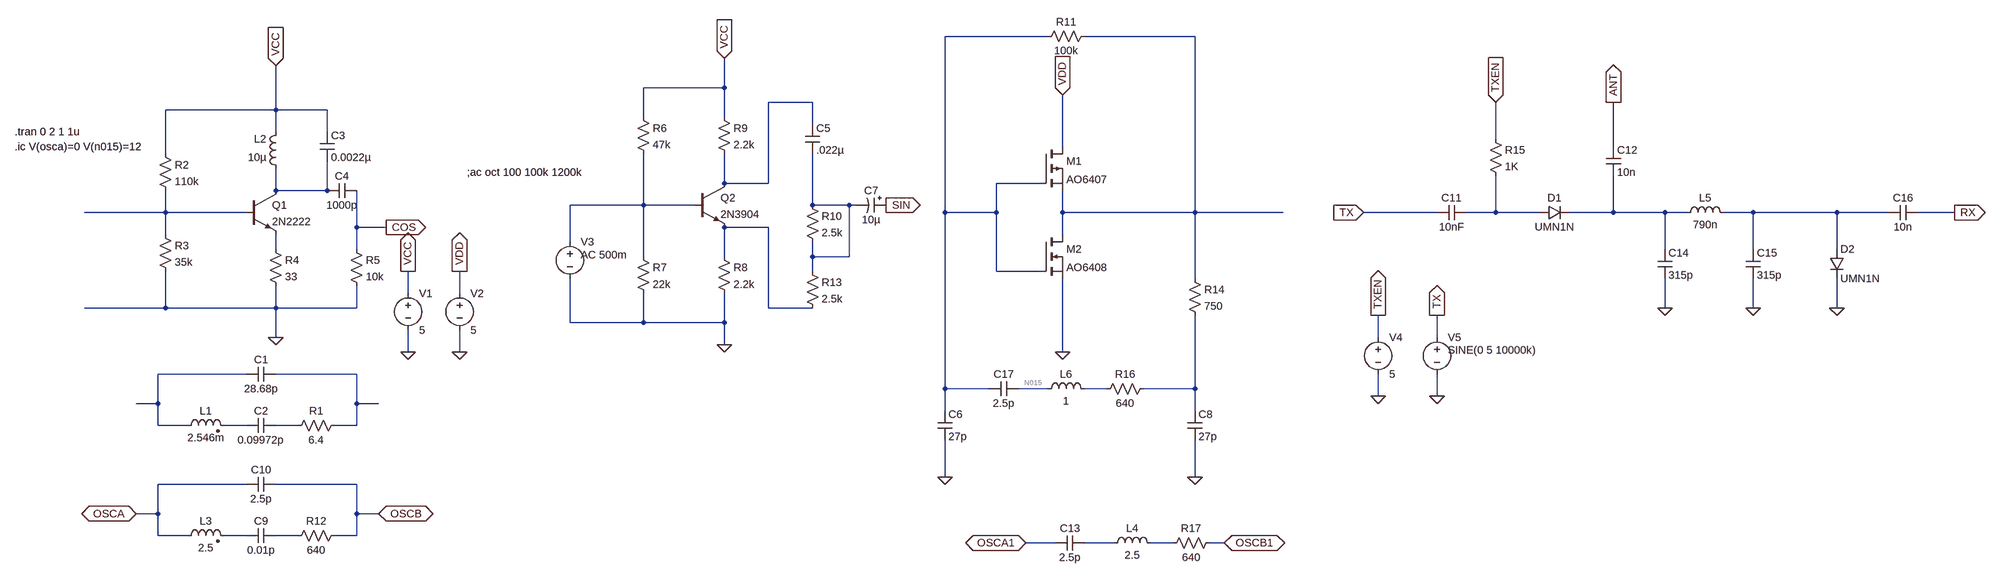
[diagram p0: schematic Draft1.asc]
Draft1.asc, the LTspice schematic file:
Version 4
SHEET 1 4968 712
WIRE 2784 -528 2560 -528
WIRE 3104 -528 2864 -528
WIRE 2080 -416 2080 -480
WIRE 2080 -416 1904 -416
WIRE 2272 -384 2176 -384
WIRE 1104 -368 1104 -464
WIRE 1104 -368 864 -368
WIRE 1216 -368 1104 -368
WIRE 1904 -352 1904 -416
WIRE 2080 -352 2080 -416
WIRE 2272 -336 2272 -384
WIRE 1104 -320 1104 -368
WIRE 1216 -320 1216 -368
WIRE 3872 -304 3872 -384
WIRE 2816 -288 2816 -400
WIRE 4128 -288 4128 -384
WIRE 864 -272 864 -368
WIRE 2080 -208 2080 -272
WIRE 2176 -208 2176 -384
WIRE 2176 -208 2080 -208
WIRE 2768 -208 2672 -208
WIRE 1104 -192 1104 -240
WIRE 1216 -192 1216 -256
WIRE 1216 -192 1104 -192
WIRE 1904 -160 1904 -272
WIRE 1904 -160 1744 -160
WIRE 2016 -160 1904 -160
WIRE 2272 -160 2272 -272
WIRE 2352 -160 2272 -160
WIRE 2368 -160 2352 -160
WIRE 864 -144 864 -192
WIRE 864 -144 688 -144
WIRE 1040 -144 864 -144
WIRE 2560 -144 2560 -528
WIRE 2672 -144 2672 -208
WIRE 2672 -144 2560 -144
WIRE 2816 -144 2816 -192
WIRE 3104 -144 3104 -528
WIRE 3104 -144 2816 -144
WIRE 3296 -144 3104 -144
WIRE 3744 -144 3584 -144
WIRE 3872 -144 3872 -224
WIRE 3872 -144 3808 -144
WIRE 3968 -144 3872 -144
WIRE 4128 -144 4128 -224
WIRE 4128 -144 4032 -144
WIRE 4240 -144 4128 -144
WIRE 4288 -144 4240 -144
WIRE 4432 -144 4368 -144
WIRE 4624 -144 4432 -144
WIRE 4736 -144 4624 -144
WIRE 4880 -144 4800 -144
WIRE 1280 -112 1280 -192
WIRE 1344 -112 1280 -112
WIRE 2176 -112 2080 -112
WIRE 864 -96 864 -144
WIRE 2816 -96 2816 -144
WIRE 1744 -80 1744 -160
WIRE 1104 -64 1104 -96
WIRE 1280 -64 1280 -112
WIRE 4240 -64 4240 -144
WIRE 4432 -64 4432 -144
WIRE 4624 -64 4624 -144
WIRE 1904 -48 1904 -160
WIRE 2080 -48 2080 -112
WIRE 2272 -48 2272 -80
WIRE 2352 -48 2352 -160
WIRE 2352 -48 2272 -48
WIRE 2272 -16 2272 -48
WIRE 2672 -16 2672 -144
WIRE 2768 -16 2672 -16
WIRE 3104 0 3104 -144
WIRE 1392 32 1392 -16
WIRE 1504 32 1504 -16
WIRE 864 64 864 -16
WIRE 864 64 688 64
WIRE 1104 64 1104 16
WIRE 1104 64 864 64
WIRE 1280 64 1280 16
WIRE 1280 64 1104 64
WIRE 2176 64 2176 -112
WIRE 2272 64 2176 64
WIRE 4240 64 4240 0
WIRE 4432 64 4432 0
WIRE 4624 64 4624 0
WIRE 1744 96 1744 0
WIRE 1904 96 1904 32
WIRE 1904 96 1744 96
WIRE 2080 96 2080 32
WIRE 2080 96 1904 96
WIRE 1104 128 1104 64
WIRE 3616 128 3616 80
WIRE 3744 128 3744 80
WIRE 2080 144 2080 96
WIRE 1392 160 1392 112
WIRE 1504 160 1504 112
WIRE 2816 160 2816 0
WIRE 1040 208 848 208
WIRE 1280 208 1104 208
WIRE 2560 240 2560 -144
WIRE 2656 240 2560 240
WIRE 2784 240 2720 240
WIRE 2912 240 2864 240
WIRE 3104 240 3104 80
WIRE 3104 240 2992 240
WIRE 3616 256 3616 208
WIRE 3744 256 3744 208
WIRE 848 272 848 208
WIRE 848 272 800 272
WIRE 1280 272 1280 208
WIRE 1328 272 1280 272
WIRE 2560 288 2560 240
WIRE 3104 288 3104 240
WIRE 848 320 848 272
WIRE 912 320 848 320
WIRE 1040 320 992 320
WIRE 1152 320 1104 320
WIRE 1280 320 1280 272
WIRE 1280 320 1232 320
WIRE 2560 432 2560 352
WIRE 3104 432 3104 352
WIRE 1040 448 848 448
WIRE 1280 448 1104 448
WIRE 848 512 848 448
WIRE 848 512 800 512
WIRE 1280 512 1280 448
WIRE 1328 512 1280 512
WIRE 848 560 848 512
WIRE 912 560 848 560
WIRE 1040 560 992 560
WIRE 1152 560 1104 560
WIRE 1280 560 1280 512
WIRE 1280 560 1232 560
WIRE 2800 576 2736 576
WIRE 2928 576 2864 576
WIRE 3056 576 3008 576
WIRE 3168 576 3136 576
FLAG 1392 -16 VCC
IOPIN 1392 -16 Out
FLAG 1104 -464 VCC
IOPIN 1104 -464 In
FLAG 1104 128 0
FLAG 1392 160 0
FLAG 1504 160 0
FLAG 1504 -16 VDD
IOPIN 1504 -16 Out
FLAG 2080 144 0
FLAG 1344 -112 COS
IOPIN 1344 -112 Out
FLAG 2432 -160 SIN
IOPIN 2432 -160 Out
FLAG 2080 -480 VCC
IOPIN 2080 -480 In
FLAG 800 512 OSCA
IOPIN 800 512 BiDir
FLAG 1328 512 OSCB
IOPIN 1328 512 BiDir
FLAG 2816 -400 VDD
IOPIN 2816 -400 In
FLAG 2816 160 0
FLAG 2560 432 0
FLAG 3104 432 0
FLAG 3872 -384 TXEN
IOPIN 3872 -384 In
FLAG 4240 64 0
FLAG 4432 64 0
FLAG 4624 64 0
FLAG 3616 256 0
FLAG 3616 80 TXEN
IOPIN 3616 80 Out
FLAG 3744 256 0
FLAG 3744 80 TX
IOPIN 3744 80 Out
FLAG 3584 -144 TX
IOPIN 3584 -144 In
FLAG 4880 -144 RX
IOPIN 4880 -144 Out
FLAG 4128 -384 ANT
IOPIN 4128 -384 Out
FLAG 2736 576 OSCA1
IOPIN 2736 576 BiDir
FLAG 3168 576 OSCB1
IOPIN 3168 576 BiDir
SYMBOL ind2 896 336 R270
WINDOW 0 32 56 VTop 2
WINDOW 3 5 56 VBottom 2
SYMATTR InstName L1
SYMATTR Value 2.546m
SYMATTR Type ind
SYMBOL cap 1104 304 R90
WINDOW 0 0 32 VBottom 2
WINDOW 3 32 32 VTop 2
SYMATTR InstName C2
SYMATTR Value 0.09972p
SYMBOL res 1248 304 R90
WINDOW 0 0 56 VBottom 2
WINDOW 3 32 56 VTop 2
SYMATTR InstName R1
SYMATTR Value 6.4
SYMBOL cap 1104 192 R90
WINDOW 0 0 32 VBottom 2
WINDOW 3 32 32 VTop 2
SYMATTR InstName C1
SYMATTR Value 28.68p
SYMBOL res 848 -288 R0
SYMATTR InstName R2
SYMATTR Value 110k
SYMBOL res 848 -112 R0
SYMATTR InstName R3
SYMATTR Value 35k
SYMBOL npn 1040 -192 R0
SYMATTR InstName Q1
SYMATTR Value 2N2222
SYMBOL res 1088 -80 R0
SYMATTR InstName R4
SYMATTR Value 33
SYMBOL res 1264 -80 R0
SYMATTR InstName R5
SYMATTR Value 10k
SYMBOL ind 1120 -224 R180
WINDOW 0 36 80 Left 2
WINDOW 3 36 40 Left 2
SYMATTR InstName L2
SYMATTR Value 10µ
SYMATTR SpiceLine Ipk=0.225 Rser=1.2 Rpar=0 Cpar=0 mfg="Murata" pn="LQH2MCN100K02"
SYMBOL cap 1200 -320 R0
SYMATTR InstName C3
SYMATTR Value 0.0022µ
SYMBOL cap 1280 -208 R90
WINDOW 0 0 32 VBottom 2
WINDOW 3 32 32 VTop 2
SYMATTR InstName C4
SYMATTR Value 1000p
SYMBOL voltage 1392 16 R0
WINDOW 123 0 0 Left 0
WINDOW 39 0 0 Left 0
SYMATTR InstName V1
SYMATTR Value 5
SYMBOL voltage 1504 16 R0
WINDOW 123 0 0 Left 0
WINDOW 39 24 124 Left 2
SYMATTR InstName V2
SYMATTR Value 5
SYMBOL npn 2016 -208 R0
SYMATTR InstName Q2
SYMATTR Value 2N3904
SYMBOL res 2064 -64 R0
SYMATTR InstName R8
SYMATTR Value 2.2k
SYMBOL res 1888 -64 R0
SYMATTR InstName R7
SYMATTR Value 22k
SYMBOL res 2064 -368 R0
SYMATTR InstName R9
SYMATTR Value 2.2k
SYMBOL res 1888 -368 R0
SYMATTR InstName R6
SYMATTR Value 47k
SYMBOL cap 2256 -336 R0
SYMATTR InstName C5
SYMATTR Value .022µ
SYMBOL polcap 2432 -176 R90
WINDOW 0 0 32 VBottom 2
WINDOW 3 32 32 VTop 2
SYMATTR InstName C7
SYMATTR Value 10µ
SYMBOL ind2 896 576 R270
WINDOW 0 32 56 VTop 2
WINDOW 3 5 56 VBottom 2
SYMATTR InstName L3
SYMATTR Value 2.5
SYMATTR Type ind
SYMBOL cap 1104 544 R90
WINDOW 0 0 32 VBottom 2
WINDOW 3 32 32 VTop 2
SYMATTR InstName C9
SYMATTR Value 0.01p
SYMBOL res 1248 544 R90
WINDOW 0 0 56 VBottom 2
WINDOW 3 32 56 VTop 2
SYMATTR InstName R12
SYMATTR Value 640
SYMBOL cap 1104 432 R90
WINDOW 0 0 32 VBottom 2
WINDOW 3 32 32 VTop 2
SYMATTR InstName C10
SYMATTR Value 2.5p
SYMBOL res 2256 -176 R0
SYMATTR InstName R10
SYMATTR Value 2.5k
SYMBOL res 2256 -32 R0
SYMATTR InstName R13
SYMATTR Value 2.5k
SYMBOL voltage 1744 -96 R0
WINDOW 123 24 44 Left 2
WINDOW 39 0 0 Left 0
SYMATTR Value2 AC 500m
SYMATTR InstName V3
SYMATTR Value ""
SYMBOL ind 2912 592 R270
WINDOW 0 32 56 VTop 2
WINDOW 3 5 56 VBottom 2
SYMATTR InstName L4
SYMATTR Value 2.5
SYMBOL res 3152 560 R90
WINDOW 0 0 56 VBottom 2
WINDOW 3 32 56 VTop 2
SYMATTR InstName R17
SYMATTR Value 640
SYMBOL cap 2864 560 R90
WINDOW 0 0 32 VBottom 2
WINDOW 3 32 32 VTop 2
SYMATTR InstName C13
SYMATTR Value 2.5p
SYMBOL res 2880 -544 R90
WINDOW 0 0 56 VBottom 2
WINDOW 3 32 56 VTop 2
SYMATTR InstName R11
SYMATTR Value 100k
SYMBOL res 3088 -16 R0
SYMATTR InstName R14
SYMATTR Value 750
SYMBOL pmos 2768 -288 R0
SYMATTR InstName M1
SYMATTR Value AO6407
SYMBOL nmos 2768 -96 R0
SYMATTR InstName M2
SYMATTR Value AO6408
SYMBOL cap 2544 288 R0
SYMATTR InstName C6
SYMATTR Value 27p
SYMBOL cap 3088 288 R0
SYMATTR InstName C8
SYMATTR Value 27p
SYMBOL cap 3808 -160 R90
WINDOW 0 0 32 VBottom 2
WINDOW 3 32 32 VTop 2
SYMATTR InstName C11
SYMATTR Value 10nF
SYMBOL res 3856 -320 R0
SYMATTR InstName R15
SYMATTR Value 1K
SYMBOL diode 3968 -128 R270
WINDOW 0 32 32 VTop 2
WINDOW 3 0 32 VBottom 2
SYMATTR InstName D1
SYMATTR Value UMN1N
SYMBOL cap 4112 -288 R0
SYMATTR InstName C12
SYMATTR Value 10n
SYMBOL cap 4224 -64 R0
SYMATTR InstName C14
SYMATTR Value 315p
SYMBOL ind 4272 -128 R270
WINDOW 0 32 56 VTop 2
WINDOW 3 5 56 VBottom 2
SYMATTR InstName L5
SYMATTR Value 790n
SYMBOL cap 4416 -64 R0
SYMATTR InstName C15
SYMATTR Value 315p
SYMBOL diode 4608 -64 R0
SYMATTR InstName D2
SYMATTR Value UMN1N
SYMBOL cap 4800 -160 R90
WINDOW 0 0 32 VBottom 2
WINDOW 3 32 32 VTop 2
SYMATTR InstName C16
SYMATTR Value 10n
SYMBOL voltage 3616 112 R0
WINDOW 123 0 0 Left 0
WINDOW 39 24 124 Left 2
SYMATTR InstName V4
SYMATTR Value 5
SYMBOL voltage 3744 112 R0
WINDOW 123 0 0 Left 0
WINDOW 39 24 124 Left 2
WINDOW 3 24 44 Left 2
SYMATTR Value SINE(0 5 10000k)
SYMATTR InstName V5
SYMBOL ind 2768 256 R270
WINDOW 0 32 56 VTop 2
WINDOW 3 5 56 VBottom 2
SYMATTR InstName L6
SYMATTR Value 1
SYMBOL res 3008 224 R90
WINDOW 0 0 56 VBottom 2
WINDOW 3 32 56 VTop 2
SYMATTR InstName R16
SYMATTR Value 640
SYMBOL cap 2720 224 R90
WINDOW 0 0 32 VBottom 2
WINDOW 3 32 32 VTop 2
SYMATTR InstName C17
SYMATTR Value 2.5p
TEXT 536 -320 Left 2 !.tran 0 2 1 1u
TEXT 536 -288 Left 2 !.ic V(osca)=0 V(n015)=12
TEXT 1520 -232 Left 2 !;ac oct 100 100k 1200k

The netlist it stands for:
* Draft1.asc
L1 N013 N018 2.546m
C2 N019 N018 0.09972p
R1 N014 N019 6.4
C1 N014 N013 28.68p
R2 VCC N007 110k
R3 N007 0 35k
Q1 N004 N007 N012 0 2N2222
R4 N012 0 33
R5 COS 0 10k
L2 N004 VCC 10µ Ipk=0.225 Rser=1.2 Rpar=0 Cpar=0 mfg="Murata" pn="LQH2MCN100K02"
C3 VCC N004 0.0022µ
C4 COS N004 1000p
V1 VCC 0 5
V2 VDD 0 5
Q2 N003 N005 N011 0 2N3904
R8 N011 0 2.2k
R7 N005 0 22k
R9 VCC N003 2.2k
R6 VCC N005 47k
C5 N003 N006 .022µ
C7 SIN N006 10µ
L3 OSCA N020 2.5
C9 N021 N020 0.01p
R12 OSCB N021 640
C10 OSCB OSCA 2.5p
R10 N006 N006 2.5k
R13 N006 N011 2.5k
V3 N005 0 AC 500m
L4 N022 N023 2.5
R17 OSCB1 N023 640
C13 N022 OSCA1 2.5p
R11 N002 N001 100k
R14 N002 N017 750
M1 VDD N001 N002 N002 AO6407
M2 N002 N001 0 0 AO6408
C6 N001 0 27p
C8 N017 0 27p
C11 N008 TX 10nF
R15 TXEN N008 1K
D1 N008 N009 UMN1N
C12 ANT N009 10n
C14 N009 0 315p
L5 N009 N010 790n
C15 N010 0 315p
D2 N010 0 UMN1N
C16 RX N010 10n
V4 TXEN 0 5
V5 TX 0 SINE(0 5 10000k)
L6 N015 N016 1
R16 N017 N016 640
C17 N015 N001 2.5p
.model D D
.lib standard.dio
.model NPN NPN
.model PNP PNP
.lib standard.bjt
.model NMOS NMOS
.model PMOS PMOS
.lib standard.mos
.tran 0 2 1 1u
.ic V(osca)=0 V(n015)=12
;ac oct 100 100k 1200k
.backanno
.end